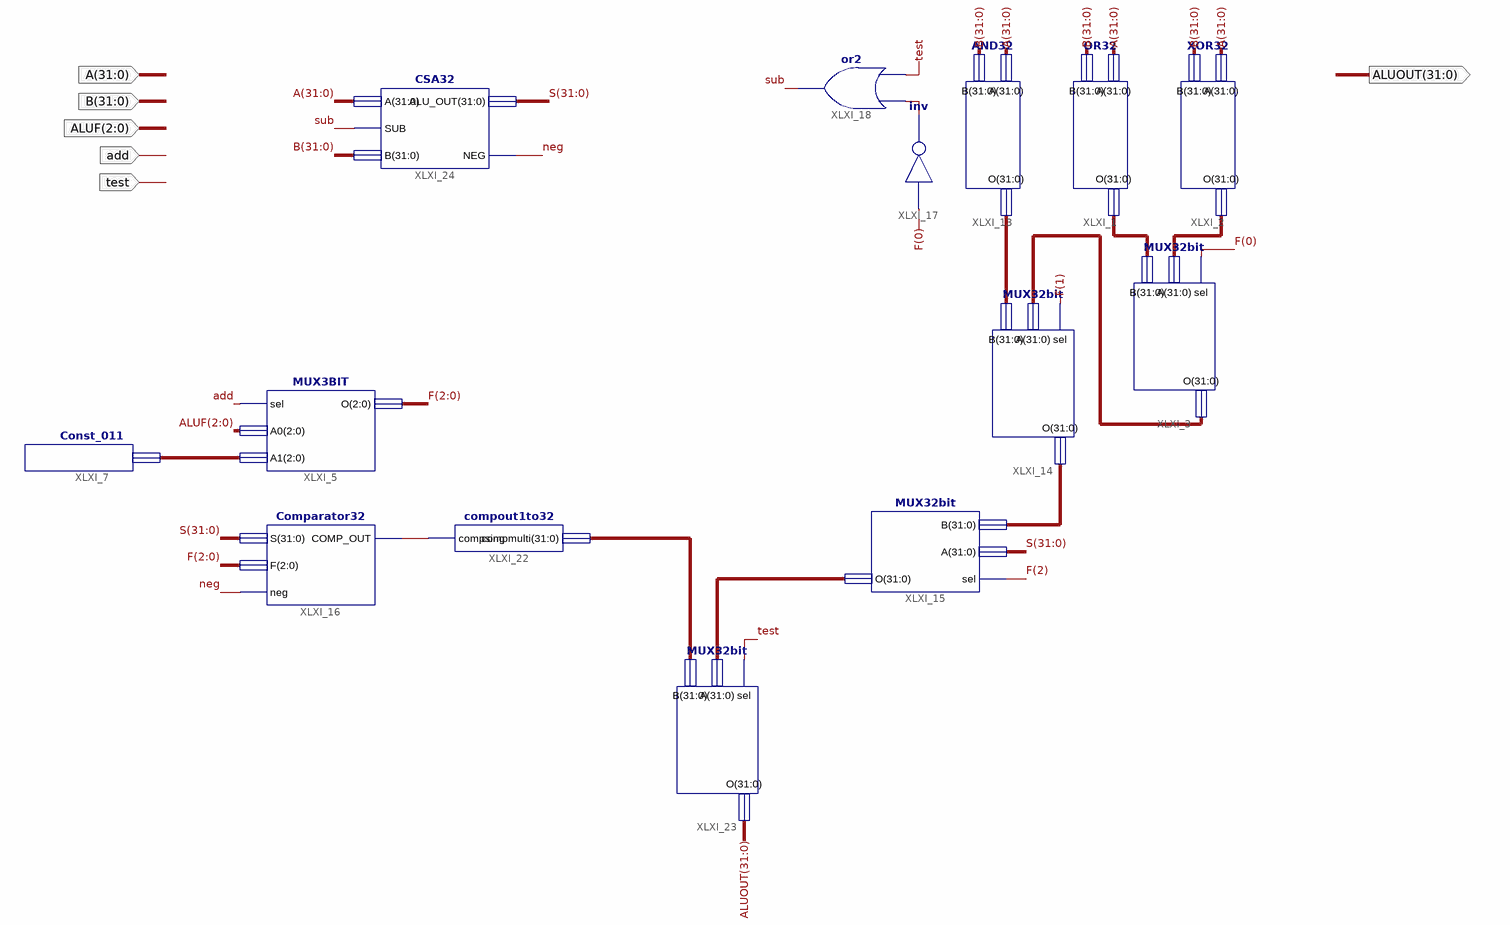
[diagram p0: schematic sheet 1]
// Xilinx ISE schematic ALU_Envi.sch (spartan6) as structural Verilog: 14 symbols, 6 ports
module ALU_Envi (
  input  [31:0] A,
  input  [31:0] B,
  input  [2:0] ALUF,
  input  add,
  input  test,
  output [31:0] ALUOUT
);

  wire neg, sub, XLXN_46, XLXN_47;
  wire [2:0] F, XLXN_18;
  wire [31:0] S, XLXN_10, XLXN_11, XLXN_34, XLXN_36, XLXN_40, XLXN_69, XLXN_70;

  OR32 XLXI_1 (.A(A), .B(B), .O(XLXN_10));
  XOR32 XLXI_2 (.A(A), .B(B), .O(XLXN_11));
  MUX32bit XLXI_3 (.sel(F[0]), .A(XLXN_11), .B(XLXN_10), .O(XLXN_36));
  AND32 XLXI_13 (.A(A), .B(B), .O(XLXN_34));
  MUX32bit XLXI_14 (.sel(F[1]), .A(XLXN_36), .B(XLXN_34), .O(XLXN_40));
  MUX32bit XLXI_15 (.sel(F[2]), .A(S), .B(XLXN_40), .O(XLXN_69));
  not XLXI_17 (XLXN_47, F[0]);
  or XLXI_18 (sub, test, XLXN_47);
  MUX3BIT XLXI_5 (.sel(add), .A0(ALUF), .A1(XLXN_18), .O(F));
  Const_011 XLXI_7 (.constOut(XLXN_18));
  Comparator32 XLXI_16 (.S(S), .F(F), .neg(neg), .COMP_OUT(XLXN_46));
  compout1to32 XLXI_22 (.compsing(XLXN_46), .compmulti(XLXN_70));
  MUX32bit XLXI_23 (.sel(test), .A(XLXN_69), .B(XLXN_70), .O(ALUOUT));
  CSA32 XLXI_24 (.A(A), .SUB(sub), .B(B), .ALU_OUT(S), .NEG(neg));
endmodule
